# EAGLE design RTC_Cape_A1 (EAGLE 6.5.0)
AUTHOR: HIEU DUONG; CCO: WWW.CIRCUITCO.COM; DN: 999-0004279; REV: A1; TITLE: RTC CAPE
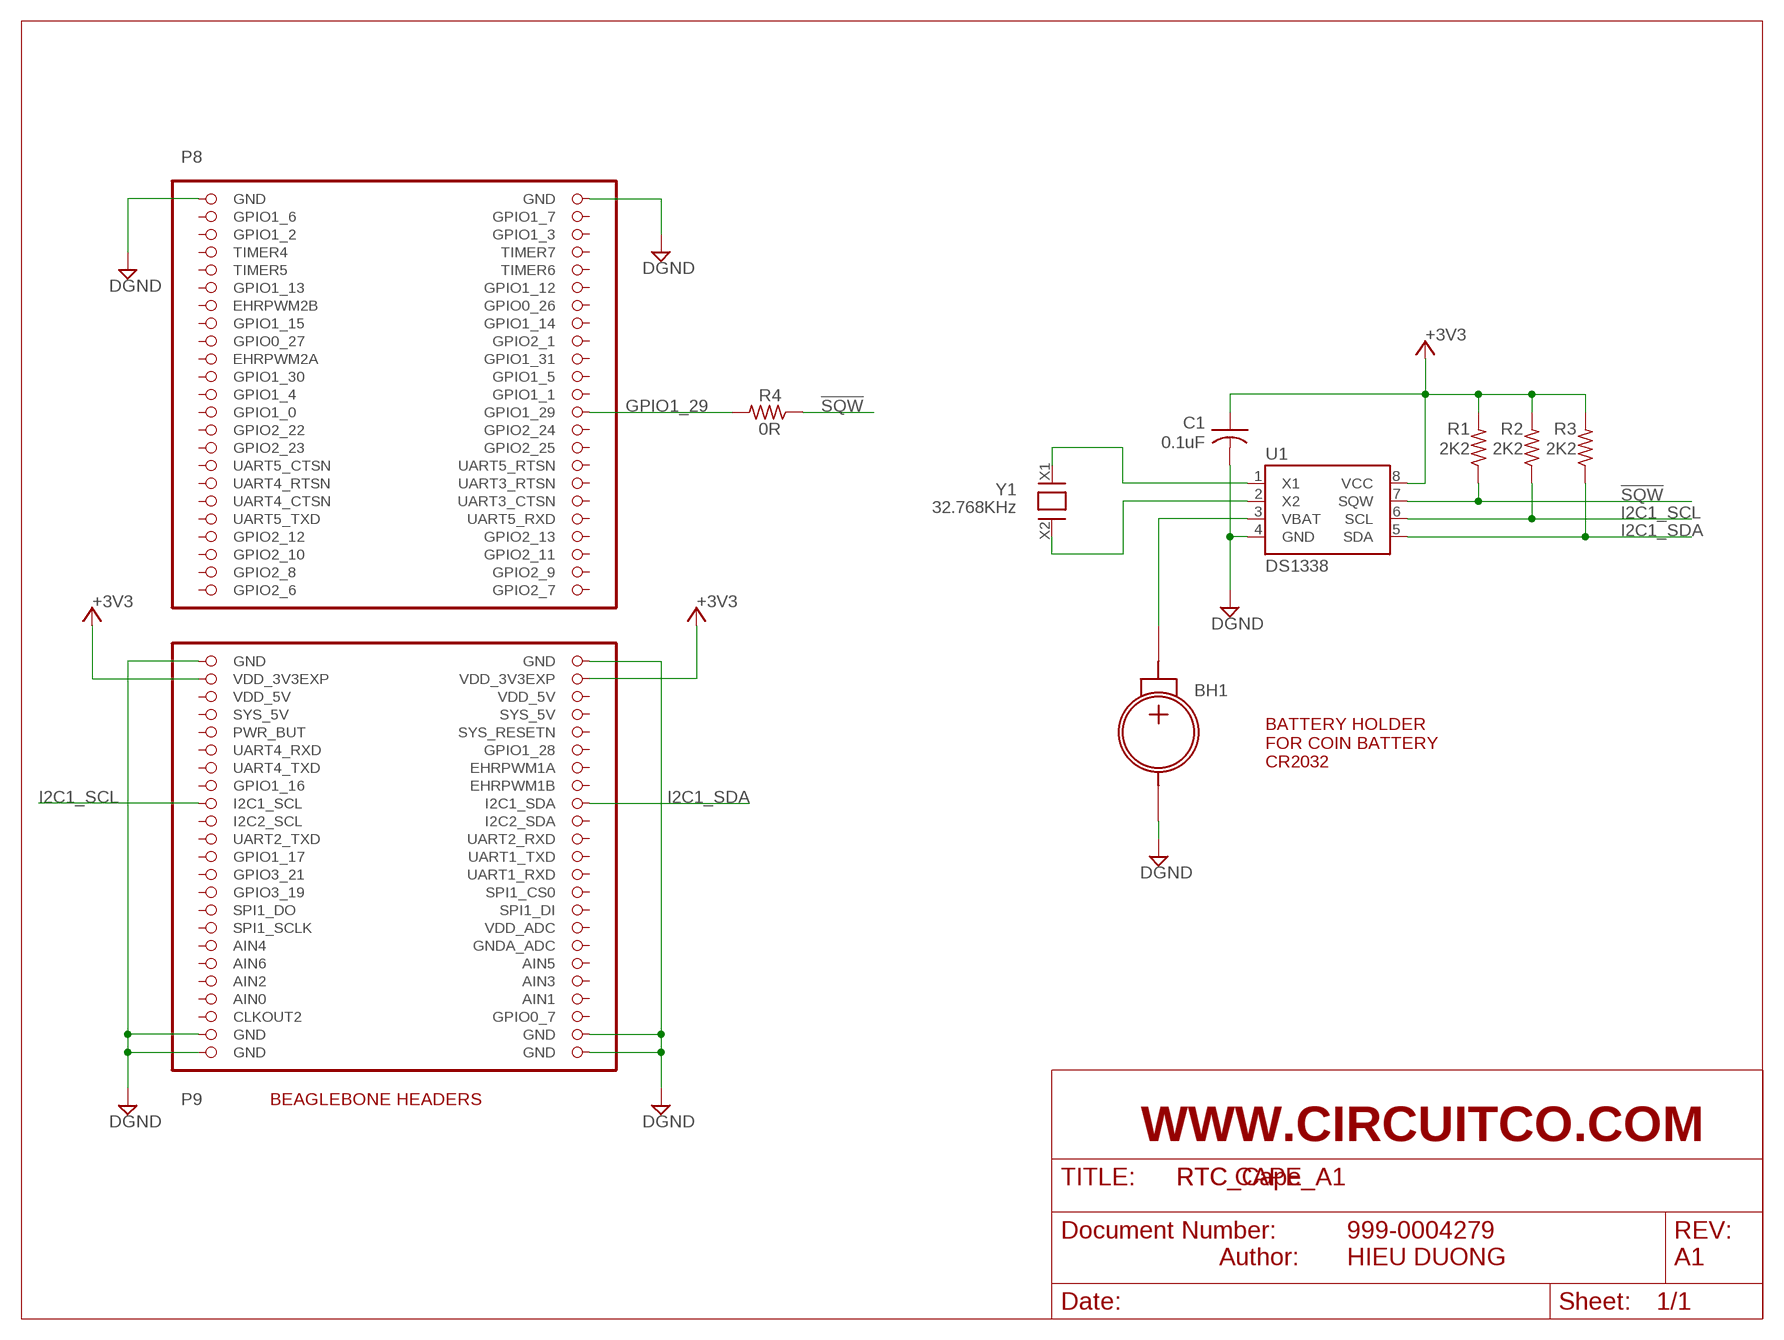
[diagram p0: schematic, sheet 1]

## Parts
BH1  BS-7  [BS-7]
C1  0.1uF  C-USC0402  [C0402]
R1  2K2  R-US_R0402  [R0402]
R2  2K2  R-US_R0402  [R0402]
R3  2K2  R-US_R0402  [R0402]
R4  0R  R-US_R0402  [R0402]
U1  DS1338  RTC-DS1338Z-33+  [MXM-SOIC8-90-0112]
U$1  BB_OL_GENPROTO  [BB_OL_GENPROTO]
Y1  32.768KHz  CFS308-32.768KDZF  [CRYSTAL-CFS-308-SMD]

## Nets
!SQW: R1.1 R4.1 U1.7(SQW)
+3V3: C1.1 R1.2 R2.2 R3.2 U1.8(VCC) U$1.49(VDD_3V3EXP) U$1.50(VDD_3V3EXP)
DGND: BH1.NEG C1.2 U1.4(GND) U$1.1(GND) U$1.2(GND) U$1.47(GND) U$1.48(GND) U$1.89(GND) U$1.90(GND) U$1.91(GND) U$1.92(GND)
GPIO1_29: R4.2 U$1.26(GPIO1_29)
I2C1_SCL: R2.1 U1.6(SCL) U$1.63(I2C1_SCL)
I2C1_SDA: R3.1 U1.5(SDA) U$1.64(I2C1_SDA)
N$1: BH1.POS U1.3(VBAT)
N$2: U1.2(X2) Y1.X2
N$3: U1.1(X1) Y1.X1
Unconnected: U$1.3(GPIO1_6) U$1.4(GPIO1_7) U$1.5(GPIO1_2) U$1.6(GPIO1_3) U$1.7(TIMER4) U$1.8(TIMER7) U$1.9(TIMER5) U$1.10(TIMER6) U$1.11(GPIO1_13) U$1.12(GPIO1_12) U$1.13(EHRPWM2B) U$1.14(GPIO0_26) U$1.15(GPIO1_15) U$1.16(GPIO1_14) U$1.17(GPIO0_27) U$1.18(GPIO2_1) U$1.19(EHRPWM2A) U$1.20(GPIO1_31) U$1.21(GPIO1_30) U$1.22(GPIO1_5) U$1.23(GPIO1_4) U$1.24(GPIO1_1) U$1.25(GPIO1_0) U$1.27(GPIO2_22) U$1.28(GPIO2_24) U$1.29(GPIO2_23) U$1.30(GPIO2_25) U$1.31(UART5_CTSN) U$1.32(UART5_RTSN) U$1.33(UART4_RTSN) U$1.34(UART3_RTSN) U$1.35(UART4_CTSN) U$1.36(UART3_CTSN) U$1.37(UART5_TXD) U$1.38(UART5_RXD) U$1.39(GPIO2_12) U$1.40(GPIO2_13) U$1.41(GPIO2_10) U$1.42(GPIO2_11) U$1.43(GPIO2_8) U$1.44(GPIO2_9) U$1.45(GPIO2_6) U$1.46(GPIO2_7) U$1.54(SYS_5V) U$1.55(PWR_BUT) U$1.56(SYS_RESETN) U$1.57(UART4_RXD) U$1.58(GPIO1_28) U$1.59(UART4_TXD) U$1.60(EHRPWM1A) U$1.61(GPIO1_16) U$1.62(EHRPWM1B) U$1.65(I2C2_SCL) U$1.66(I2C2_SDA) U$1.67(UART2_TXD) U$1.68(UART2_RXD) U$1.69(GPIO1_17) U$1.70(UART1_TXD) U$1.71(GPIO3_21) U$1.72(UART1_RXD) U$1.73(GPIO3_19) U$1.74(SPI1_CS0) U$1.75(SPI1_DO) U$1.76(SPI1_DI) U$1.77(SPI1_SCLK) U$1.78(VDD_ADC) U$1.79(AIN4) U$1.80(GNDA_ADC) U$1.81(AIN6) U$1.82(AIN5) U$1.83(AIN2) U$1.84(AIN3) U$1.86(AIN1) U$1.87(CLKOUT2) U$1.88(GPIO0_7)

## Notes on the sheet
- P8
- BATTERY HOLDER
  FOR COIN BATTERY
  CR2032
- P9 | BEAGLEBONE HEADERS
- Author:

## Power pins joined to a net without a drawn wire
AIN0: U$1.85(AIN0)
SYS_5V: U$1.53(SYS_5V)
VDD_5V: U$1.51(VDD_5V) U$1.52(VDD_5V)

## Library data of the parts
BH1 = circuitco-eagle:BS-7
C1 = resistor:C-US: CAPACITOR, American symbol
R1-R4 = resistor:R-US_: RESISTOR, American symbol
U1 = circuitco-eagle:RTC-DS*; DESCRIPTION: IC RTC CLK/CALENDAR I2C 8-SOIC; MAN: MAXIM
U$1 = circuitco-eagle:BB_OL_GENPROTO
Y1 = circuitco-eagle:CFS308-32.768KDZF

## Board
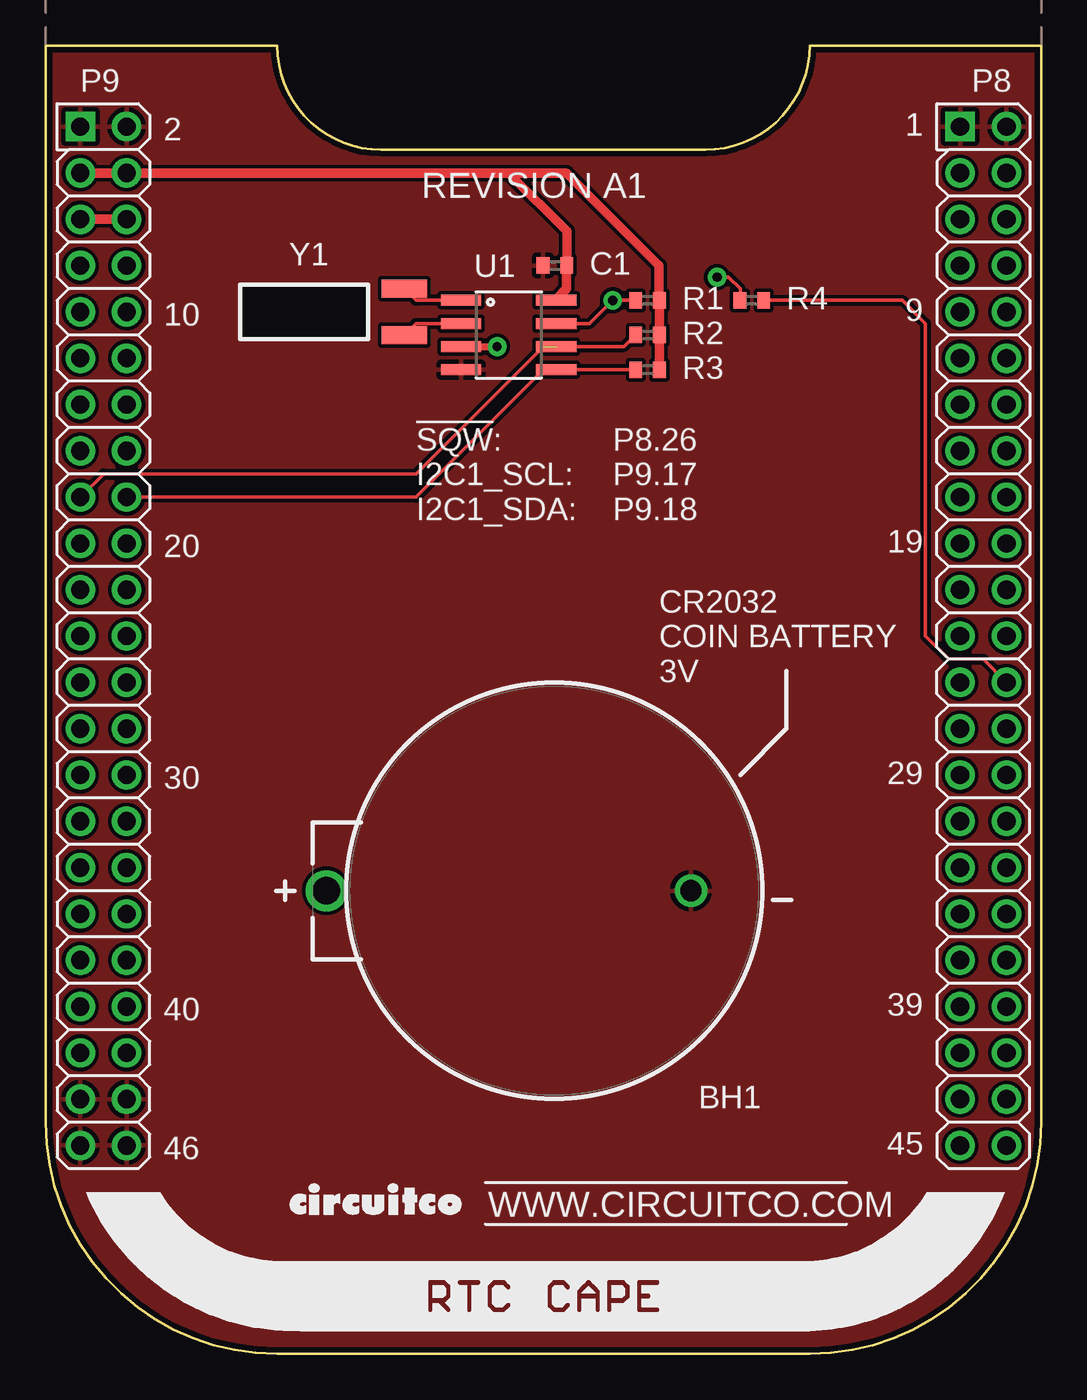
[diagram p1: board, top side]
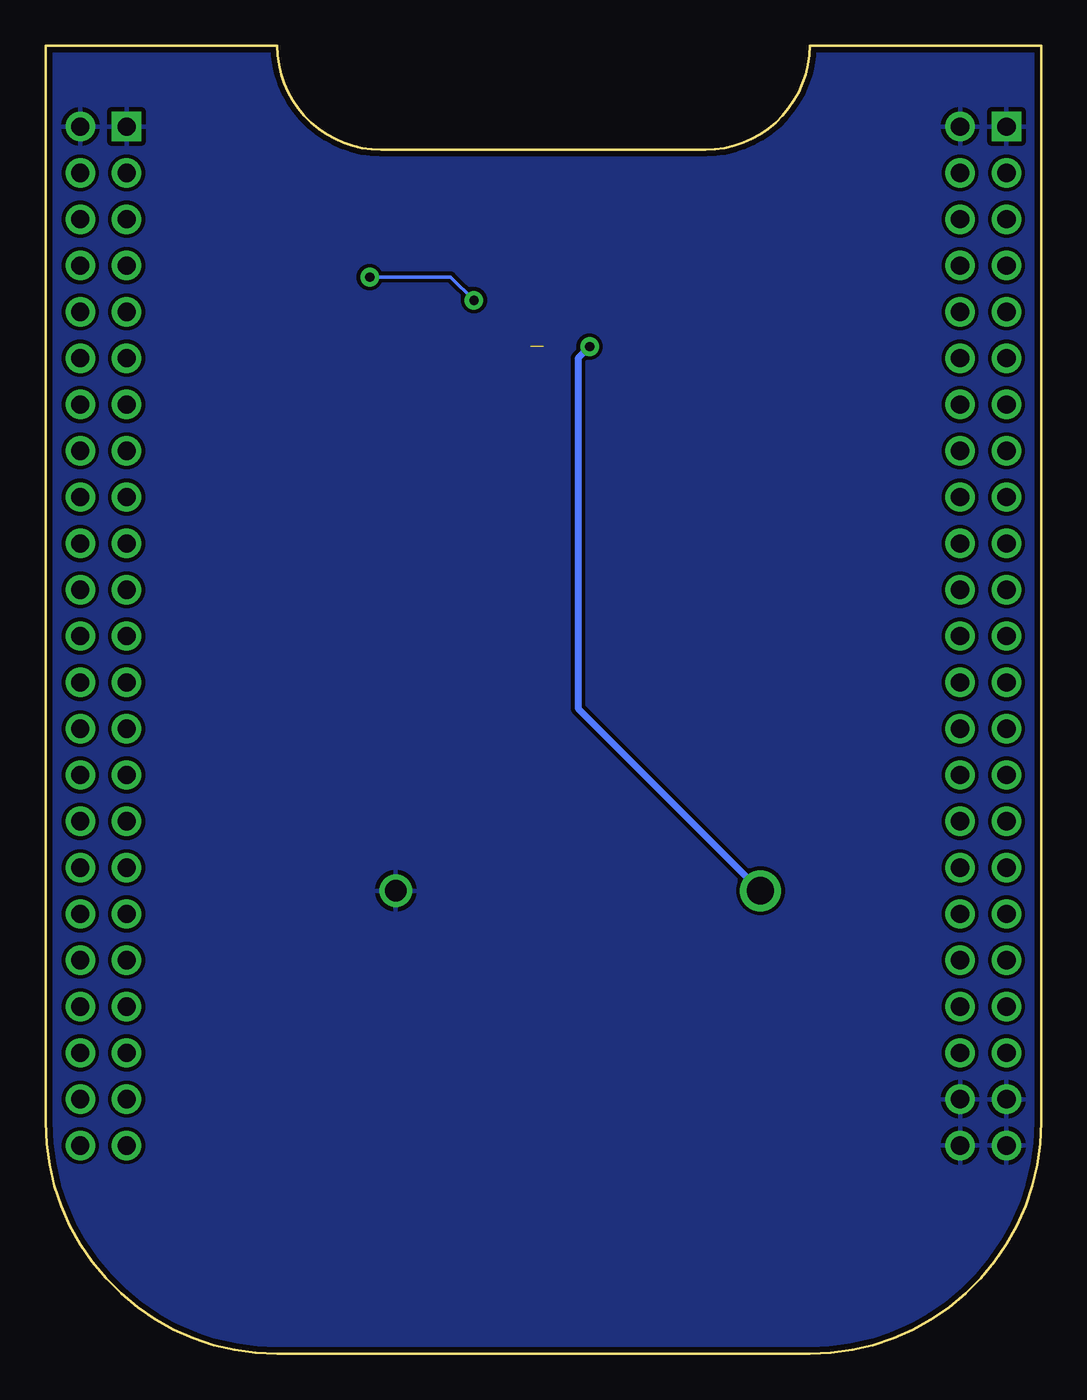
[diagram p2: board, bottom side, seen from below]

Size 54.61 x 71.75 mm. Coordinates in mm from the lower left corner, seen from the top.
Copper layers (1*16): Top 0.035mm / dielectric 1.5mm / Bottom 0.035mm
Design rules "CircuitCo-HD": minimum track width 8mil, minimum drill 15mil, track to track 8mil, track to pad 8mil, pad to pad 3mil, via to via 8mil, smd to smd 0mil, copper to edge 12mil, drill to drill 8mil, minimum pad ring 12mil, minimum via ring 10mil, stop-mask expansion 4mil, vias tented up to drill 25mil, thermal gap 10mil

### Footprints (pad centres in the part's own frame; a part is rotated, then mirrored left to right if it is on the bottom)
BS-7 = drill 1.17: NEG -10,0 | drill 1.5: POS 10,0
C0402 = smd 0.7 x 0.9: 1 -0.65,0; 2 0.65,0
R0402 = smd 0.7 x 0.9: 1 -0.65,0; 2 0.65,0
MXM-SOIC8-90-0112 = smd 0.61 x 2.21: 1 -1.905,-2.616; 2 -0.635,-2.616; 3 0.635,-2.616; 4 1.905,-2.616; 5 1.905,2.616; 6 0.635,2.616; 7 -0.635,2.616; 8 -1.905,2.616
BB_OL_GENPROTO = drill 1 square: 1 50.165,67.31; 47 1.905,67.31 | drill 1: 2 52.705,67.31; 3 50.165,64.77; 4 52.705,64.77; 5 50.165,62.23; 6 52.705,62.23; 7 50.165,59.69; 8 52.705,59.69; 9 50.165,57.15; 10 52.705,57.15; 11 50.165,54.61; 12 52.705,54.61; 13 50.165,52.07; 14 52.705,52.07; 15 50.165,49.53; 16 52.705,49.53; 17 50.165,46.99; 18 52.705,46.99; 19 50.165,44.45; 20 52.705,44.45; 21 50.165,41.91; 22 52.705,41.91; 23 50.165,39.37; 24 52.705,39.37; 25 50.165,36.83; 26 52.705,36.83; 27 50.165,34.29; 28 52.705,34.29; 29 50.165,31.75; 30 52.705,31.75; 31 50.165,29.21; 32 52.705,29.21; 33 50.165,26.67; 34 52.705,26.67; 35 50.165,24.13; 36 52.705,24.13; 37 50.165,21.59; 38 52.705,21.59; 39 50.165,19.05; 40 52.705,19.05; 41 50.165,16.51; 42 52.705,16.51; 43 50.165,13.97; 44 52.705,13.97; 45 50.165,11.43; 46 52.705,11.43; 48 4.445,67.31; 49 1.905,64.77; 50 4.445,64.77; 51 1.905,62.23; 52 4.445,62.23; 53 1.905,59.69; 54 4.445,59.69; 55 1.905,57.15; 56 4.445,57.15; 57 1.905,54.61; 58 4.445,54.61; 59 1.905,52.07; 60 4.445,52.07; 61 1.905,49.53; 62 4.445,49.53; 63 1.905,46.99; 64 4.445,46.99; 65 1.905,44.45; 66 4.445,44.45; 67 1.905,41.91; 68 4.445,41.91; 69 1.905,39.37; 70 4.445,39.37; 71 1.905,36.83; 72 4.445,36.83; 73 1.905,34.29; 74 4.445,34.29; 75 1.905,31.75; 76 4.445,31.75; 77 1.905,29.21; 78 4.445,29.21; 79 1.905,26.67; 80 4.445,26.67; 81 1.905,24.13; 82 4.445,24.13; 83 1.905,21.59; 84 4.445,21.59; 85 1.905,19.05; 86 4.445,19.05; 87 1.905,16.51; 88 4.445,16.51; 89 1.905,13.97; 90 4.445,13.97; 91 1.905,11.43; 92 4.445,11.43
CRYSTAL-CFS-308-SMD = smd 1 x 2.5: X1 1.27,0; X2 -1.27,0

### Placement (x,y rotation side)
BH1  25.4,25.4 180 top
C1  27.94,59.69 180 top
DRILEGEND  [DRILEGEND]  -1.16,-17.36 0 top  (outside the outline)
R1  33.02,57.78 0 top
R2  33.02,55.88 0 top
R3  33.02,53.98 0 top
R4  38.73,57.78 0 top
U1  25.4,55.88 270 top
U$1  0,0 0 top
U$2  [CIRCUITCO-LOGO]  13.34,7.49 0 top
U$3  [NEGA-RTC-NAME]  0.64,0.64 0 top
Y1  19.68,57.15 90 top

### Tracks (layer width: path | path; a pad name or v marks a point on that pad's centre or on a via)
!SQW  (via drill 0.51)
  Top 0.203: U1.7 29.84,56.52 v31.11,57.78 R1.1 | v36.83,59.05 37.47,59.05 38.1,58.42 38.1,57.8 R4.1
  Bottom 0.203: v31.11,57.78 32.38,59.05 v36.83,59.05
+3V3
  Top 0.508: R3.2 R2.2 R1.2 33.66,57.8 33.66,59.69 28.57,64.77 25.4,64.77 | U1.8 28.02,57.86 28.57,58.42 28.57,59.67 C1.1 28.59,61.58 25.4,64.77 | U$1.49 U$1.50 25.4,64.77
DGND
  pour Bottom: 0,72.39 54.61,72.39 54.61,0 0,0
  pour Top: 0,72.39 54.61,72.39 54.61,0 0,0
GPIO1_29
  Top 0.203: R4.2 46.99,57.78 48.26,56.52 48.26,39.37 49.53,38.1 51.44,38.1 U$1.26
I2C1_SCL  (1 unrouted)
  Top 0.203: U$1.63 3.17,48.26 20.32,48.26 27.3,55.24 31.73,55.24 R2.1
I2C1_SDA
  Top 0.203: R3.1 U1.5 27.3,53.98 20.32,46.99 U$1.64
N$1  (via drill 0.51)
  Top 0.381: U1.3 v24.77,55.24
  Bottom 0.381: v24.77,55.24 25.4,54.61 25.4,35.4 BH1.POS
N$2
  Top 0.203: U1.2 20.32,56.52 Y1.X2
N$3
  Top 0.203: U1.1 20.32,57.78 Y1.X1
VDD_5V
  Top 0.508: U$1.52 U$1.51

### Text on the board
tPlace: 1 | 2 | REVISION A1 | 9 | 10 | !SQW!: / I2C1_SCL: / I2C1_SDA: | P8.26 / P9.17 / P9.18 | 19 | 20 | CR2032 / COIN BATTERY / 3V | 29 | 30 | 39 | 40 | 45 | 46 | WWW.CIRCUITCO.COM
tNames: P9 | P8
Document: RTC CAPE REV A1 / ASSEMBLY DRAWING - TOP VIEW
DrillLegend: -ALL DIMENSIONS IN INCHES UNESS | OTHERWISE NOTED | - NO. LAYERS: 2 | - ARRAY: NO | - BOARD SIZE: 2.150000 x 2.825000 In. | - X-OUTS ALLOWED: YES | - SCORING: YES | - JUMP SCORING: NO | - TAB ROUT: NO | - MATERIAL: FR-4 | - FINAL THICKNESS: 0.062000 | - PLATING: IMMERSION GOLD | - OUTER CU WEIGHT: 1.000000 | - MASK SIDES: BOTH | - MASK COLOR: WHITE | - SILKSCREEN SIDES: FRONT | - SILKSCREEN COLOR: BLACK | - GOLD FINGERS: NO | - MIN TRACE/SPACE: 8 | - MIN HOLE SIZE: 15 | - NO. HOLES UNDER 12 MIL: 0 | - PLATED SLOTS: NO | - PLATED EDGES: NO | - RoHS COMPLIANT: YES | - ITAR COMPLIANT: NO | - CONFORM TO IPC-A-600, CLASS 2: YES | - CLASS 3: NO | - MILSPEC: NO | - ADD UL LOGO: YES | - ADD DATE CODE: YES | - ADD 94V-0 MARKINGS: YES | - COUNTERSINKS/BORES: NO | - CONTROLLED DIELECTRIC: NO | - CARBON INK: NO | - BLIND/BURRIED VIAS: NO | - VIA IN PAD: NO | - MASK PLUGGED VIAS: NO | - CONDUCTIVE FILLED VIAS: NO | - CONTROLLED IMPEDANCE: NO | LAYER-STACK
DrillLegend_01-16: 01-16